# EAGLE design lp_redir (EAGLE 6.4)
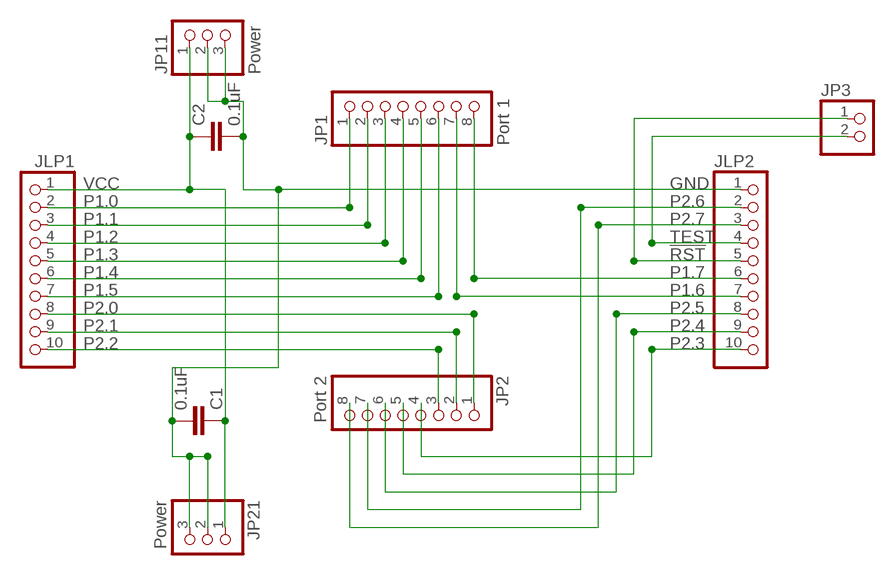
[diagram p0: schematic, sheet 1]

## Parts
C1  0.1uF  C-EU025-025X050  [C025-025X050]
C2  0.1uF  C-EU025-025X050  [C025-025X050]
JLP1  PH1X10OCT076  [PH1X10OCT76]
JLP2  PH1X10OCT076  [PH1X10OCT76]
JP1  Port 1  PINHD-1X8  [1X08]
JP2  Port 2  PINHD-1X8  [1X08]
JP3  PINHD-1X2  [1X02]
JP11  Power  PINHD-1X3  [1X03]
JP21  Power  PINHD-1X3  [1X03]

## Nets
!RST: JLP2.5 JP3.1
GND [GND]: C1.2 C2.2 JLP2.1 JP11.2 JP11.3 JP21.2 JP21.3
P1.0: JLP1.2 JP1.1
P1.1: JLP1.3 JP1.2
P1.2: JLP1.4 JP1.3
P1.3: JLP1.5 JP1.4
P1.4: JLP1.6 JP1.5
P1.5: JLP1.7 JP1.6
P1.6: JLP2.7 JP1.7
P1.7: JLP2.6 JP1.8
P2.0: JLP1.8 JP2.1
P2.1: JLP1.9 JP2.2
P2.2: JLP1.10 JP2.3
P2.3: JLP2.10 JP2.4
P2.4: JLP2.9 JP2.5
P2.5: JLP2.8 JP2.6
P2.6: JLP2.2 JP2.7
P2.7: JLP2.3 JP2.8
TEST: JLP2.4 JP3.2
VCC [VCC]: C1.1 C2.1 JLP1.1 JP11.1 JP21.1

## Library data of the parts
C1 C2 = resistor:C-EU: CAPACITOR, European symbol
JLP1 JLP2 = MY_CONN:PH1X10
JP1 JP2 = pinhead:PINHD-1X8: PIN HEADER
JP3 = pinhead:PINHD-1X2: PIN HEADER
JP11 JP21 = pinhead:PINHD-1X3: PIN HEADER

## Net classes
0 default: width 0.406 mm
1 GND: width 0.762 mm, drill 0.508 mm, clearance 0.254 mm
2 VCC: width 0.762 mm, drill 0.508 mm, clearance 0.508 mm

## Board
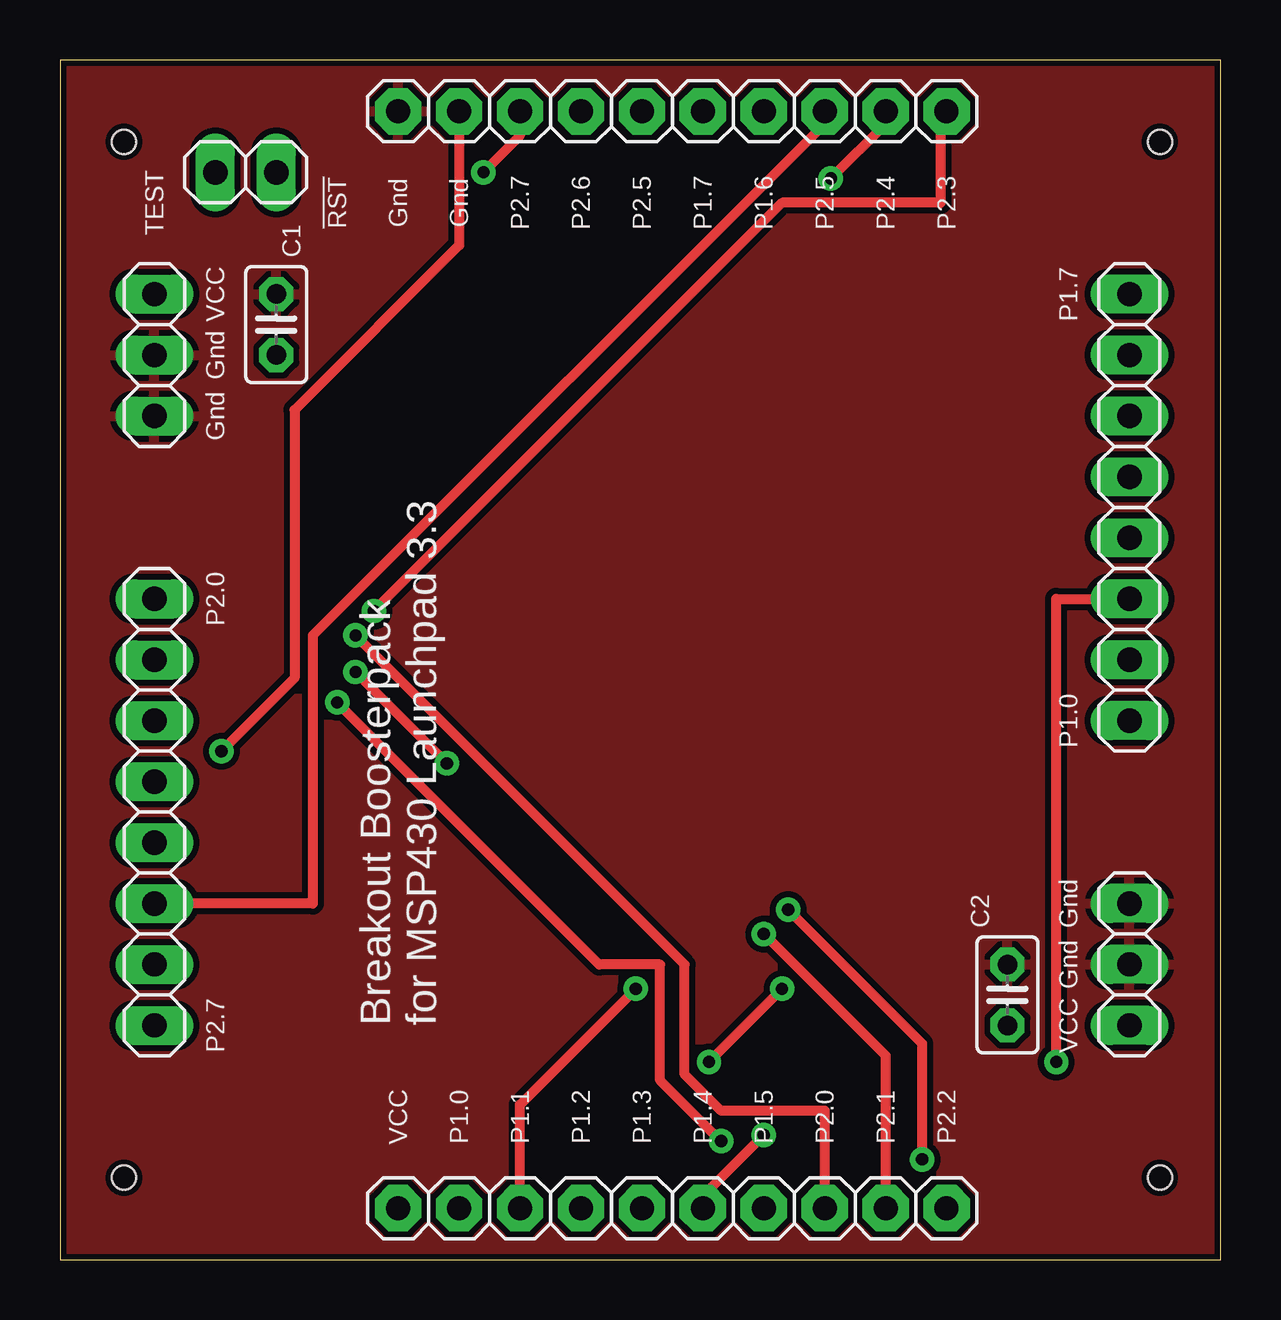
[diagram p1: board, top side]
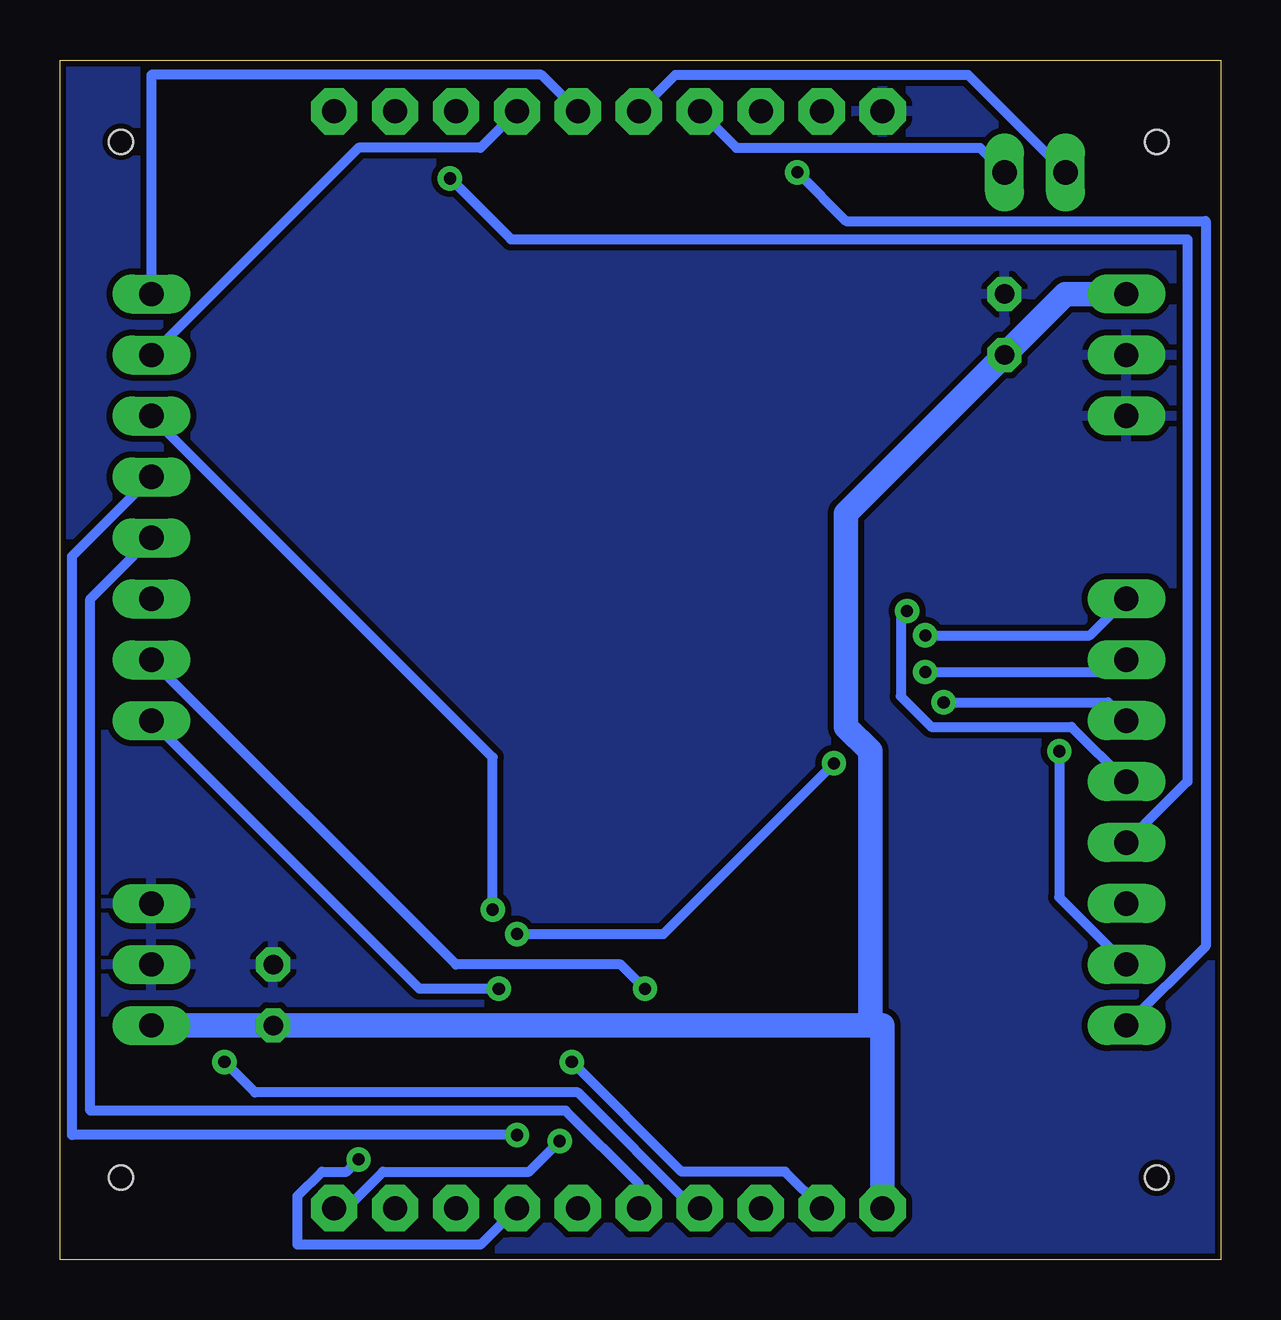
[diagram p2: board, bottom side, seen from below]

Size 48.39 x 50 mm. Coordinates in mm from the lower left corner, seen from the top.
Outline: 0,0 48.39,0 48.39,50 0,50 0,0
Copper layers (1*16): Top 0.035mm / dielectric 1.5mm / Bottom 0.035mm
Design rules "SparkFun *": minimum track width 16mil, minimum drill 20mil, track to track 8mil, track to pad 8mil, pad to pad 8mil, via to via 8mil, smd to smd 8mil, copper to edge 10mil, drill to drill 8mil, minimum pad ring 12mil, minimum via ring 10mil, stop-mask expansion 4mil, vias tented up to drill 25mil, thermal gap 10mil
Holes 1 mm at 45.85,46.59 45.85,3.41 2.67,3.41 2.67,46.59

### Footprints (pad centres in the part's own frame; a part is rotated, then mirrored left to right if it is on the bottom)
C025-025X050 = drill 0.813 octagon: 1 -1.27,0; 2 1.27,0
PH1X10OCT76 = drill 1 pad 1.93 octagon: 1 0,0; 2 2.54,0; 3 5.08,0; 4 7.62,0; 5 10.16,0; 6 12.7,0; 7 15.24,0; 8 17.78,0; 9 20.32,0; 10 22.86,0
1X08 = drill 1.016 long: 1 -8.89,0; 2 -6.35,0; 3 -3.81,0; 4 -1.27,0; 5 1.27,0; 6 3.81,0; 7 6.35,0; 8 8.89,0
1X02 = drill 1.016 long: 1 -1.27,0; 2 1.27,0
1X03 = drill 1.016 long: 1 -2.54,0; 2 0,0; 3 2.54,0

### Placement (x,y rotation side)
C1  9.02,38.97 90 top
C2  39.5,11.03 90 top
JLP1  14.1,2.14 0 top
JLP2  14.1,47.86 0 top
JP1  44.58,31.35 90 top
JP2  3.94,18.65 270 top
JP3  7.75,45.32 0 top
JP11  44.58,12.3 90 top
JP21  3.94,37.7 270 top

### Tracks (layer width: path | path; a pad name or v marks a point on that pad's centre or on a via)
!RST
  Bottom 0.406: JP3.1 10.54,49.38 22.73,49.38 JLP2.5
GND
  pour Top: 0.13,50.4 49.66,50.4 49.66,-0.4 -1.14,-0.4 -1.14,50.4
  pour Bottom: 0.13,50.4 49.66,50.4 49.66,-0.4 -1.14,-0.4 -1.14,50.4
P1.0  (via drill 0.51)
  Top 0.406: v27.05,8.24 v30.1,11.28
  Bottom 0.406: JP1.1 33.4,11.28 v30.1,11.28 | v27.05,8.24 22.48,3.66 18.16,3.66 JLP1.2
P1.1  (via drill 0.51)
  Top 0.406: v24,11.28 19.18,6.46 JLP1.3
  Bottom 0.406: JP1.2 31.88,12.3 25.02,12.3 v24,11.28
P1.2  (via drill 0.51)
  Top 0.406: JP1.3 41.53,27.54 v41.53,8.24
  Bottom 0.406: v41.53,8.24 40.26,6.97 26.8,6.97 21.97,2.14 JLP1.4
P1.3
  Bottom 0.406: JP1.4 47.12,27.54 47.12,6.2 27.3,6.2 24.26,3.16 JLP1.5
P1.4  (via drill 0.51)
  Top 0.406: v29.34,5.19 26.8,2.65 JLP1.6
  Bottom 0.406: JP1.5 47.88,29.32 47.88,5.19 v29.34,5.19
P1.5  (via drill 0.51)
  Top 0.406: v30.35,14.59 35.94,9 v35.94,4.17
  Bottom 0.406: JP1.6 30.35,20.94 v30.35,14.59 | v35.94,4.17 36.45,3.66 37.46,3.66 38.48,2.65 38.48,0.62 30.86,0.62 JLP1.7
P1.6
  Bottom 0.406: JP1.7 35.94,46.34 30.86,46.34 JLP2.7
P1.7
  Bottom 0.406: JP1.8 44.58,49.38 28.32,49.38 JLP2.6
P2.0  (via drill 0.51)
  Top 0.406: v12.32,26.02 26.04,12.3 26.04,7.73 27.56,6.2 31.88,6.2 JLP1.8
  Bottom 0.406: JP2.1 5.46,26.02 v12.32,26.02
P2.1  (via drill 0.51)
  Top 0.406: v16.13,20.68 v12.32,24.49 | v29.34,13.57 34.42,8.49 JLP1.9
  Bottom 0.406: JP2.2 4.45,24.49 v12.32,24.49 | v16.13,20.68 23.24,13.57 v29.34,13.57
P2.2  (via drill 0.51)
  Top 0.406: v11.56,23.22 22.48,12.3 25.02,12.3 25.02,7.47 v27.56,4.93
  Bottom 0.406: JP2.3 4.7,23.22 v11.56,23.22 | v27.56,4.93 28.83,3.66 34.92,3.66 36.45,2.14 JLP1.10
P2.3  (via drill 0.51)
  Top 0.406: v13.08,27.03 30.1,44.05 36.7,44.05 36.7,47.61 JLP2.10
  Bottom 0.406: JP2.4 6.22,22.21 12.06,22.21 13.33,23.48 13.33,27.03 v13.08,27.03
P2.4  (via drill 0.51)
  Top 0.406: v32.13,45.07 34.42,47.35 JLP2.9
  Bottom 0.406: JP2.5 1.4,19.92 1.4,42.53 29.59,42.53 v32.13,45.07
P2.5
  Top 0.406: JP2.6 10.54,14.84 10.54,26.02 31.88,47.35 JLP2.8
P2.6  (via drill 0.51)
  Top 0.406: v6.73,21.19 9.78,24.24 9.78,35.41 16.64,42.27 JLP2.2
  Bottom 0.406: JP2.7 6.73,15.09 v6.73,21.19
P2.7  (via drill 0.51)
  Top 0.406: v17.65,45.32 19.18,46.84 JLP2.3
  Bottom 0.406: JP2.8 0.64,13.06 0.64,43.29 15.62,43.29 v17.65,45.32
TEST
  Bottom 0.406: JP3.2 10.03,46.34 20.19,46.34 JLP2.4
VCC
  Bottom 0.762: 14.1,9.76 14.6,9.76 14.6,10.01 | 39.24,9.76 C2.1 | 9.27,37.45 C1.1
  Bottom 1.016: C1.1 6.48,40.24 JP21.1 | JP11.1 C2.1 | 14.1,9.76 JLP1.1 | 39.24,9.76 14.6,9.76 | 9.27,37.45 15.62,31.1 15.62,22.21 14.6,21.19 14.6,10.01

### Text on the board
tNames: TEST | !RST | Gnd | Gnd | P2.7 | P2.6 | P2.5 | P1.7 | P1.6 | P2.5 | P2.4 | P2.3 | VCC | P1.7 | Gnd | Gnd | P2.0 | P1.0 | Gnd | Gnd | P2.7 | Breakout Boosterpack / for MSP430 Launchpad 3.3 | VCC | VCC | P1.0 | P1.1 | P1.2 | P1.3 | P1.4 | P1.5 | P2.0 | P2.1 | P2.2